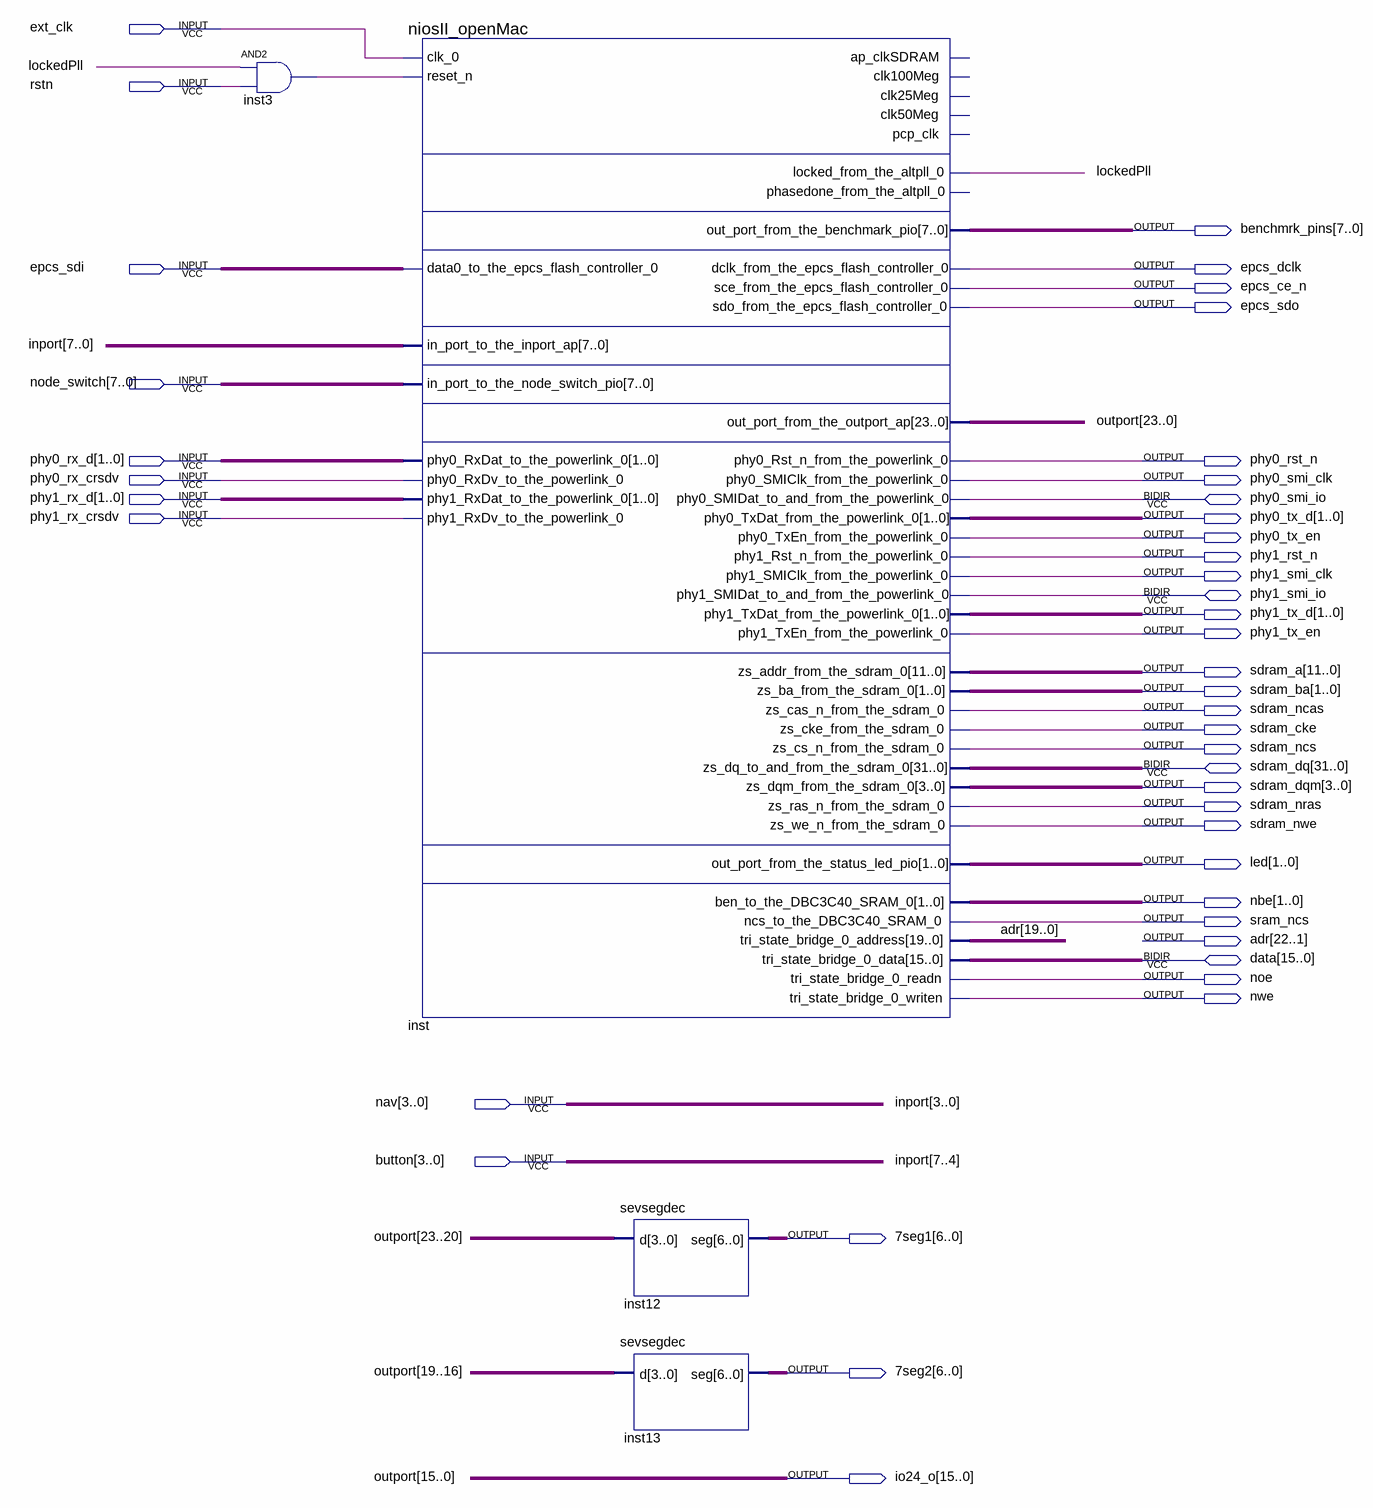
[diagram p0: schematic sheet]
// Quartus schematic nios_pll.bdf as structural Verilog: 4 symbols, 43 pins
module nios_pll (
  input  ext_clk,
  input  rstn,
  input  epcs_sdi,
  input  [7:0] node_switch,
  input  [1:0] phy0_rx_d,
  input  phy0_rx_crsdv,
  input  [1:0] phy1_rx_d,
  input  phy1_rx_crsdv,
  input  [3:0] nav,
  input  [3:0] button,
  inout  phy0_smi_io,
  inout  phy1_smi_io,
  inout  [31:0] sdram_dq,
  inout  [15:0] data,
  output [7:0] benchmrk_pins,
  output epcs_dclk,
  output epcs_ce_n,
  output epcs_sdo,
  output phy0_rst_n,
  output phy0_smi_clk,
  output [1:0] phy0_tx_d,
  output phy0_tx_en,
  output phy1_rst_n,
  output phy1_smi_clk,
  output [1:0] phy1_tx_d,
  output phy1_tx_en,
  output [11:0] sdram_a,
  output [1:0] sdram_ba,
  output sdram_ncas,
  output sdram_cke,
  output sdram_ncs,
  output [3:0] sdram_dqm,
  output sdram_nras,
  output sdram_nwe,
  output [1:0] led,
  output [1:0] nbe,
  output sram_ncs,
  output [22:0] adr,
  output noe,
  output nwe,
  output [6:0] \7seg1 ,
  output [6:0] \7seg2 ,
  output [15:0] io24_o
);

  wire inst3_out, lockedPll;
  wire [23:16] outport;

  and inst3 (inst3_out, lockedPll, rstn);
  niosII_openMac inst (
    .clk_0(ext_clk), .reset_n(inst3_out), .data0_to_the_epcs_flash_controller_0(epcs_sdi),
    .in_port_to_the_inport_ap({button, nav}), .in_port_to_the_node_switch_pio(node_switch),
    .phy0_RxDat_to_the_powerlink_0(phy0_rx_d), .phy0_RxDv_to_the_powerlink_0(phy0_rx_crsdv),
    .phy1_RxDat_to_the_powerlink_0(phy1_rx_d), .phy1_RxDv_to_the_powerlink_0(phy1_rx_crsdv),
    .locked_from_the_altpll_0(lockedPll), .out_port_from_the_benchmark_pio(benchmrk_pins),
    .dclk_from_the_epcs_flash_controller_0(epcs_dclk), .sce_from_the_epcs_flash_controller_0(epcs_ce_n),
    .sdo_from_the_epcs_flash_controller_0(epcs_sdo), .out_port_from_the_outport_ap({outport, io24_o}),
    .phy0_Rst_n_from_the_powerlink_0(phy0_rst_n), .phy0_SMIClk_from_the_powerlink_0(phy0_smi_clk),
    .phy0_TxDat_from_the_powerlink_0(phy0_tx_d), .phy0_TxEn_from_the_powerlink_0(phy0_tx_en),
    .phy1_Rst_n_from_the_powerlink_0(phy1_rst_n), .phy1_SMIClk_from_the_powerlink_0(phy1_smi_clk),
    .phy1_TxDat_from_the_powerlink_0(phy1_tx_d), .phy1_TxEn_from_the_powerlink_0(phy1_tx_en),
    .zs_addr_from_the_sdram_0(sdram_a), .zs_ba_from_the_sdram_0(sdram_ba),
    .zs_cas_n_from_the_sdram_0(sdram_ncas), .zs_cke_from_the_sdram_0(sdram_cke),
    .zs_cs_n_from_the_sdram_0(sdram_ncs), .zs_dqm_from_the_sdram_0(sdram_dqm),
    .zs_ras_n_from_the_sdram_0(sdram_nras), .zs_we_n_from_the_sdram_0(sdram_nwe),
    .out_port_from_the_status_led_pio(led), .ben_to_the_DBC3C40_SRAM_0(nbe),
    .ncs_to_the_DBC3C40_SRAM_0(sram_ncs), .tri_state_bridge_0_address(adr[19:0]),
    .tri_state_bridge_0_readn(noe), .tri_state_bridge_0_writen(nwe),
    .phy0_SMIDat_to_and_from_the_powerlink_0(phy0_smi_io),
    .phy1_SMIDat_to_and_from_the_powerlink_0(phy1_smi_io), .zs_dq_to_and_from_the_sdram_0(sdram_dq),
    .tri_state_bridge_0_data(data));  // open: ap_clkSDRAM, clk100Meg, clk25Meg, clk50Meg, pcp_clk, phasedone_from_the_altpll_0
  sevsegdec inst12 (.d(outport[23:20]), .seg(\7seg1 ));
  sevsegdec inst13 (.d(outport[19:16]), .seg(\7seg2 ));

  // Other names for the same wires on the sheet: inport[7:0] = {button, nav}; outport[15:0] = io24_o
endmodule
